# Altium schematic sheet pay-ssm.SchDoc
size A4
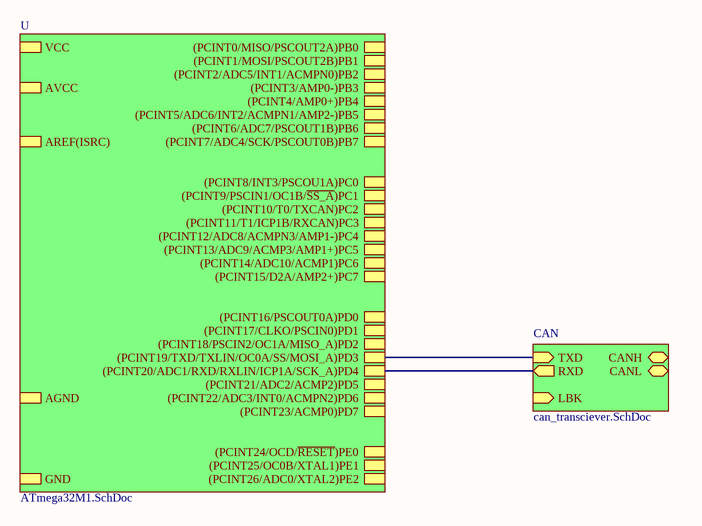
[diagram p0: pay-ssm.SchDoc]

## Sub-sheets
CAN = can_transciever.SchDoc: TXD (in), RXD (out), LBK (in), CANH (bidir), CANL (bidir)
U = ATmega32M1.SchDoc: (PCINT18/PSCIN2/OC1A/MISO_A)PD2, (PCINT19/TXD/TXLIN/OC0A/SS/MOSI_A)PD3, (PCINT9/PSCIN1/OC1B/~{SS_A})PC1, GND, (PCINT10/T0/TXCAN)PC2, (PCINT11/T1/ICP1B/RXCAN)PC3, (PCINT0/MISO/PSCOUT2A)PB0, (PCINT1/MOSI/PSCOUT2B)PB1, (PCINT25/OC0B/XTAL1)PE1, (PCINT26/ADC0/XTAL2)PE2, (PCINT20/ADC1/RXD/RXLIN/ICP1A/SCK_A)PD4, (PCINT21/ADC2/ACMP2)PD5, (PCINT22/ADC3/INT0/ACMPN2)PD6, (PCINT23/ACMP0)PD7, (PCINT2/ADC5/INT1/ACMPN0)PB2, (PCINT12/ADC8/ACMPN3/AMP1-)PC4, (PCINT13/ADC9/ACMP3/AMP1+)PC5, AVCC, AGND, AREF(ISRC), (PCINT14/ADC10/ACMP1)PC6, (PCINT3/AMP0-)PB3, (PCINT4/AMP0+)PB4, (PCINT15/D2A/AMP2+)PC7, (PCINT5/ADC6/INT2/ACMPN1/AMP2-)PB5, (PCINT6/ADC7/PSCOUT1B)PB6, (PCINT7/ADC4/SCK/PSCOUT0B)PB7, (PCINT16/PSCOUT0A)PD0, (PCINT8/INT3/PSCOU1A)PC0, (PCINT24/OCD/~{RESET})PE0, (PCINT17/CLKO/PSCIN0)PD1, VCC

## Nets
(unnamed): sheet U/(PCINT19/TXD/TXLIN/OC0A/SS/MOSI_A)PD3, sheet CAN/TXD
(unnamed): sheet U/(PCINT20/ADC1/RXD/RXLIN/ICP1A/SCK_A)PD4, sheet CAN/RXD